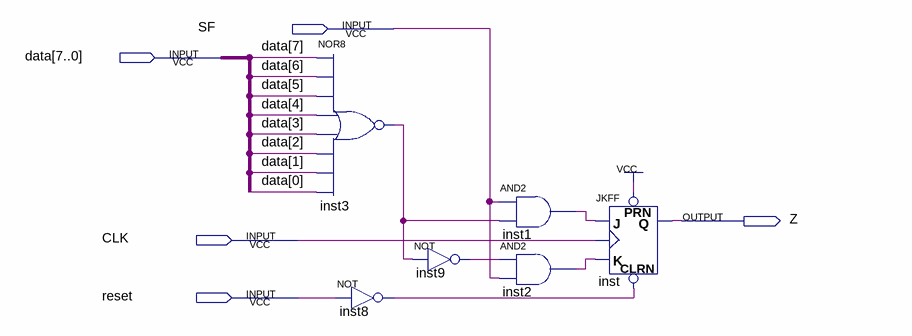
[diagram p0: schematic sheet]
// Quartus schematic ZFlag.bdf as structural Verilog: 6 symbols, 5 pins
module ZFlag (
  input  SF,
  input  [7:0] data,
  input  CLK,
  input  reset,
  output Z
);

  wire inst1_out, inst2_out, inst3_out, inst8_out, inst9_out;

  nor inst3 (inst3_out, data[7], data[6], data[5], data[4], data[3], data[2], data[1], data[0]);
  not inst8 (inst8_out, reset);
  not inst9 (inst9_out, inst3_out);
  and inst1 (inst1_out, SF, inst3_out);
  and inst2 (inst2_out, inst9_out, SF);
  JKFF inst (.PRN(1'b1), .CLRN(inst8_out), .K(inst2_out), .J(inst1_out), .CLK(CLK), .Q(Z));
endmodule
